# EAGLE design ENCF (EAGLE 8.2.2)
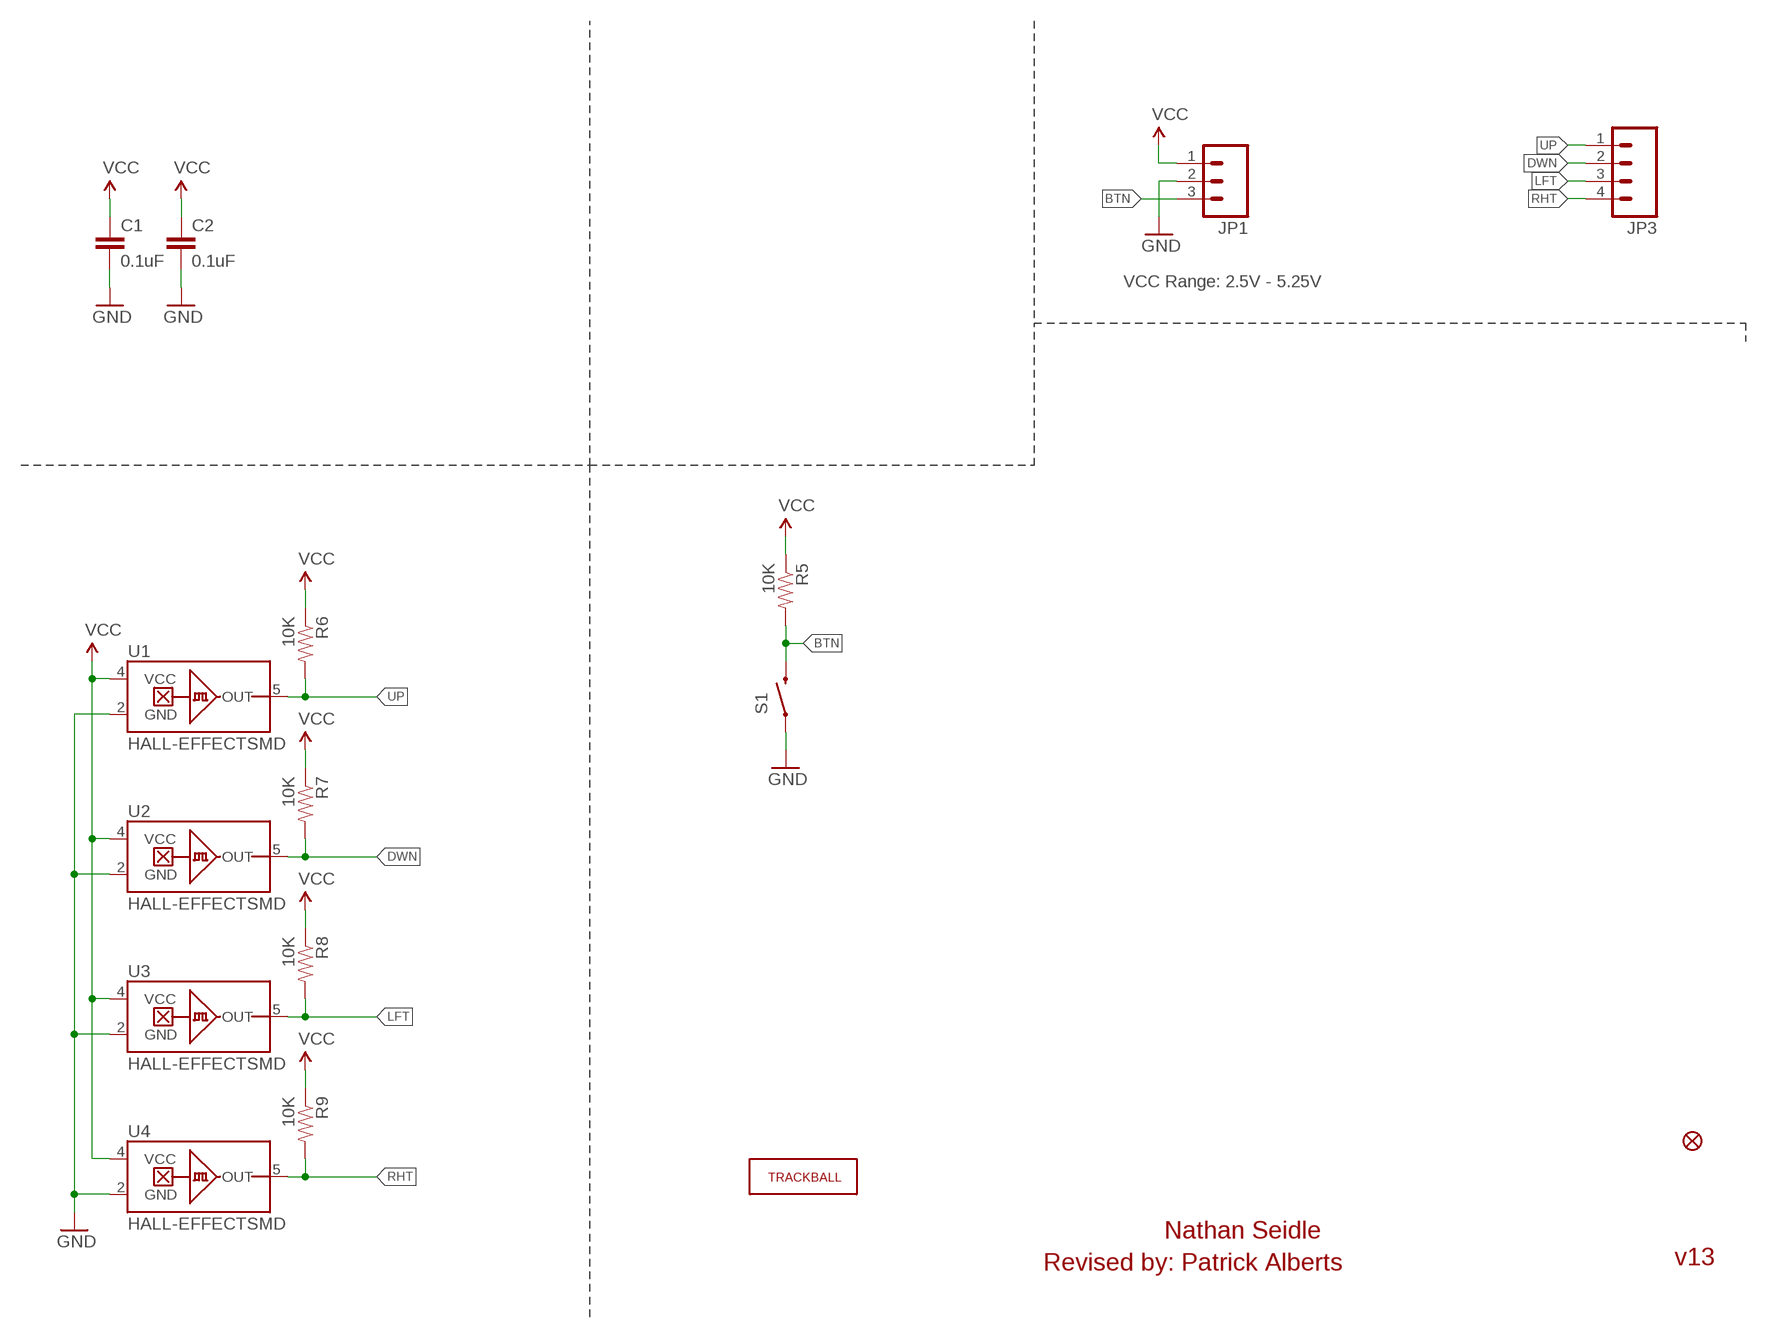
[diagram p0: schematic, sheet 1]

## Parts
C1  0.1uF  0.1UF-25V(+80/-20%)(0603)  [0603-CAP]
C2  0.1uF  0.1UF-25V(+80/-20%)(0603)  [0603-CAP]
E$2  FIDUCIAL1X2  [FIDUCIAL-1X2]
JP1  M03PTH  [1X03]
JP3  M04PTH  [1X04]
R5  10K  10KOHM1/10W1%(0603)0603  [0603-RES]
R6  10K  10KOHM1/10W1%(0603)0603  [0603-RES]
R7  10K  10KOHM1/10W1%(0603)0603  [0603-RES]
R8  10K  10KOHM1/10W1%(0603)0603  [0603-RES]
R9  10K  10KOHM1/10W1%(0603)0603  [0603-RES]
S1  SWITCH-MOMENTARY-2SMD-2  [TACTILE_SWITCH_SMD-2]
U1  HALL-EFFECTSMD  [SC70]
U2  HALL-EFFECTSMD  [SC70]
U3  HALL-EFFECTSMD  [SC70]
U4  HALL-EFFECTSMD  [SC70]
U$3  TRACKBALLMECH  [TRACKBALL]

## Nets
BTN: JP1.3 R5.2 S1.1
DWN: JP3.2 R7.2 U2.5(OUT)
GND: C1.2 C2.2 JP1.2 S1.2 U1.2(GND) U2.2(GND) U3.2(GND) U4.2(GND)
LFT: JP3.3 R8.2 U3.5(OUT)
RHT: JP3.4 R9.2 U4.5(OUT)
UP: JP3.1 R6.2 U1.5(OUT)
VCC: C1.1 C2.1 JP1.1 R5.1 R6.1 R7.1 R8.1 R9.1 U1.4(VCC) U2.4(VCC) U3.4(VCC) U4.4(VCC)

## Notes on the sheet
- VCC Range: 2.5V - 5.25V
- Nathan Seidle
- Revised by: Patrick Alberts | v13

## Library data of the parts
C1 C2 = SparkFun-Capacitors:0.1UF-25V(+80/-20%)(0603): CAP-00810 Ceramic Standard decoupling cap; PROD_ID: CAP-00810
E$2 = SparkFun:FIDUCIAL: Fiducial Alignment Points Various fiducial points for machine vision alignment.
JP1 = SparkFun:M03: Header 3 Standard 3-pin 0.1" header. Use with straight break away headers (SKU : PRT-00116), right angle break away headers (PRT-00553), swiss pins (PRT-00743), machine pins (PRT-00117), and female headers (PRT-00115). Molex polarized connector foot print use with SKU : PRT-08232 with associated crimp pins and housings.
JP3 = SparkFun:M04: Header 4 Standard 4-pin 0.1" header. Use with straight break away headers (SKU : PRT-00116), right angle break away headers (PRT-00553), swiss pins (PRT-00743), machine pins (PRT-00117), and female headers (PRT-00115). Molex polarized connector foot print use with SKU : PRT-08231 with associated crimp pins and housings.
R5-R9 = SparkFun-Resistors:10KOHM1/10W1%(0603): RES-00824; PROD_ID: RES-00824
S1 = SparkFun-Electromechanical:SWITCH-MOMENTARY-2: Various NO switches- pushbuttons, reed, etc; PROD_ID: SWCH-09213
U1-U4 = SparkFun-Sensors:HALL-EFFECT: Hall effect sensor in SC70 package; PROD_ID: IC-09214
U$3 = SparkFun-Electromechanical:TRACKBALL: Mechanical footprint for trackball; PROD_ID: COMP-09237

## Net classes
0 default: width 0.203 mm
1 power: width 0.203 mm

## Board
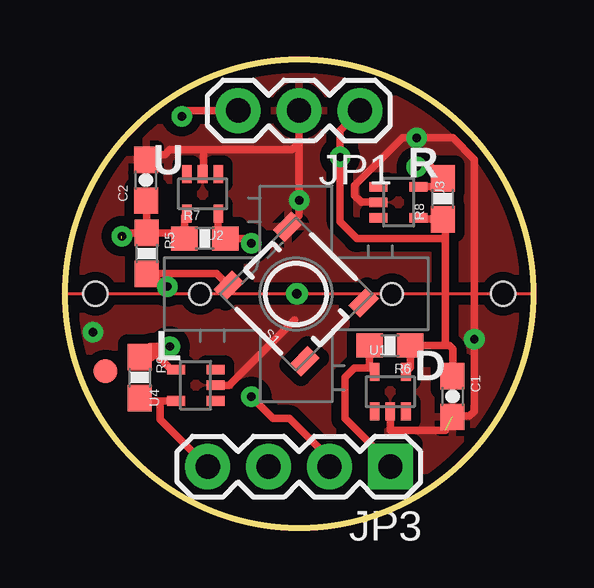
[diagram p1: board, top side]
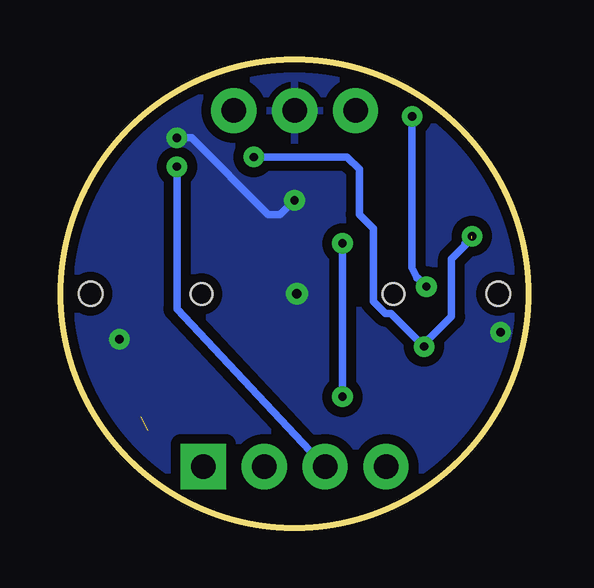
[diagram p2: board, bottom side, seen from below]

Size 19.5 x 19.5 mm. Coordinates in mm from the lower left corner, seen from the top.
Outline: circle at 9.75,9.75 radius 9.75
Copper layers (1*16): Top 0.035mm / dielectric 1.5mm / Bottom 0.035mm
Design rules "SparkFun-2-layer *": minimum track width 7mil, minimum drill 10mil, track to track 8mil, track to pad 8mil, pad to pad 8mil, via to via 8mil, smd to smd 8mil, copper to edge 8mil, drill to drill 8mil, minimum pad ring 12mil, minimum via ring 10mil, stop-mask expansion 4mil, vias tented up to drill 20mil, thermal gap 10mil
Holes 1 mm at 18.25,9.75 1.25,9.75

### Footprints (pad centres in the part's own frame; a part is rotated, then mirrored left to right if it is on the bottom)
0603-CAP = smd 1.1 x 1: 1 -0.85,0; 2 0.85,0
FIDUCIAL-1X2 = smd 1 x 1: 1 0,0
1X03 = drill 1.016 pad 1.88: 1 0,0; 2 2.54,0; 3 5.08,0
1X04 = drill 1.016 pad 1.88 square: 1 0,0 | drill 1.016 pad 1.88: 2 2.54,0; 3 5.08,0; 4 7.62,0
0603-RES = smd 1.1 x 1: 1 -0.85,0; 2 0.85,0
TACTILE_SWITCH_SMD-2 = smd 0.7 x 1.1: 1 2.225,1.75; 2 2.225,-1.75; 3 -2.225,-1.75; 4 -2.225,1.75
SC70 = smd 0.4 x 0.75: 1 -0.65,-0.825; 2 0,-0.825; 3 0.65,-0.825; 4 0.65,0.825; 5 -0.65,0.825
TRACKBALL = hole 0.9: -4,0; 4,0

### Placement (x,y rotation side)
C1  16.14,5.47 270 top
C2  3.36,14.49 90 top
E$2  1.67,6.52 180 top
JP1  12.28,17.39 180 top
JP3  13.55,2.54 180 top
R5  3.38,11.43 270 top
R6  13.53,7.59 180 top
R7  5.81,12.05 0 top
R8  15.73,13.71 90 top
R9  3.09,6.25 270 top
S1  9.62,9.74 135 top
U1  13.55,5.67 0 top
U2  5.72,13.92 180 top
U3  13.89,13.57 270 top
U4  5.44,5.93 90 top
U$3  9.62,9.74 0 top

### Tracks (layer width: path | path; a pad name or v marks a point on that pad's centre or on a via)
BTN  (via drill 0.35)
  Top 0.305: JP1.3 5.09,17.39 v4.85,17.15 | S1.1 6.3,10.58 R5.2 4.22,10.05 v4.25,10.05
  Bottom 0.305: v4.85,17.15 4.85,10.85 4.64,10.4 4.6,10.4 v4.25,10.05
DWN  (via drill 0.35)
  Top 0.305: U2.5 6.37,12.34 R7.2 7.55,12.05 v7.75,11.85 | v7.75,5.45 8.65,4.55 9.35,4.55 11.01,2.89 JP3.2
  Bottom 0.305: v7.75,11.85 v7.75,5.45 7.75,5.35
GND  (via drill 0.35, 0.4)  (1 unrouted)
  Top 0.305: 9.74,17.34 JP1.2 9.74,16.04 | 5.75,15.75 5.75,14.77 U2.2 | 5.75,15.75 4.35,15.75 4.15,15.55 3.58,15.55 C2.2 | 9.74,16.04 9.45,15.75 5.75,15.75 | 9.74,13.99 9.74,16.04 | 9.74,13.99 9.74,13.01 9.45,12.71 | 9.45,12.71 S1.2 | U3.2 12.33,13.57 12.05,13.85 12.05,14.25 14.05,16.25 v14.65,16.25 16.15,16.25 17.05,15.35 v17.05,7.85 17.05,4.85 16.85,4.65 16.17,4.65 C1.2 | v9.75,13.65 9.75,13.98 9.74,13.99 | U4.2 6.83,5.93 9.55,8.65 | 9.55,12.61 9.45,12.71 | U1.2 13.54,4.05 13.55,4.05 15.85,4.05
  Bottom 0.305: v14.65,16.25 14.05,16.25 10.85,13.05 10.35,13.05 v9.75,13.65
  other vias: 1.15,8.15 9.65,9.75
  pour Top (isolate 0.406): -0.05,10.35 arc-90 9.45,19.25 arc-90 19.45,9.95 arc-90 8.95,0.05 arc-90
  pour Bottom (isolate 0.406): -0.15,9.75 arc-90 9.55,19.45 9.65,19.45 arc-90 19.45,9.65 arc-90 9.65,0.05 arc-90 -0.05,9.25 -0.05,9.45
LFT  (via drill 0.35)
  Top 0.305: U3.5 15.39,14.22 R8.2 15.24,15.05 v14.65,15.05
  Bottom 0.305: v14.65,15.05 14.65,9.12 JP3.3
N$4  (via drill 0.35)
  other vias: 2.35,12.15
RHT
  Top 0.305: U4.5 3.95,5.28 | 3.95,5.28 3.21,5.28 R9.2 | 3.95,5.28 3.95,4.52 JP3.4
UP
  Top 0.305: 13.24,2.96 13.35,2.85 | 13.24,2.96 11.65,4.55 11.65,6.25 12.05,6.65 12.74,6.65 | 12.74,6.65 U1.5 | R6.2 12.68,6.71 12.74,6.65 | JP3.1 13.55,2.65 13.24,2.96
VCC  (via drill 0.35)  (1 unrouted)
  Top 0.305: U4.4 4.42,6.58 3.75,7.25 3.24,7.25 3.54,7.55 4.03,7.55 | U1.4 14.38,6.68 R6.1 15.85,7.59 | 15.85,7.59 16.01,7.59 16.15,7.45 C1.1 | 4.96,12.3 R7.1 | 4.96,12.3 4.96,12.98 U2.4 | 14.75,12.96 U3.4 14.77,12.86 R8.1 15.63,12.87 15.85,12.65 15.85,12.05 | R5.1 3.38,13.62 C2.1 | R5.1 4.95,12.29 4.96,12.3 | R5.1 2.49,12.29 2.35,12.15 | 15.85,7.59 15.85,12.05 | 15.85,12.05 12.15,12.05 11.45,12.75 v11.45,15.45 11.45,16.56 JP1.1 | 4.03,7.55 v4.35,7.55 | R9.1 3.59,7.1 4.03,7.55
  Bottom 0.305: v11.45,15.45 7.95,15.45 | 7.95,15.45 7.75,15.45 | 2.65,11.75 2.35,12.05 | 2.65,11.75 2.65,11.85 2.25,12.25 | 7.95,15.45 7.56,15.45 7.05,14.94 7.05,13.06 6.45,12.46 6.45,9.43 5.95,8.93 5.73,8.93 v4.35,7.55 4.35,7.65 3.2,8.8 3.2,11.2 2.65,11.75
(copper drawn outside any net)
  shapes: Top area x1

### Text on the board
tPlace: U | R | L | D